# EAGLE schematic StepperController_v1-0 (EAGLE 7.5.0)

## Sheet 1 of 4
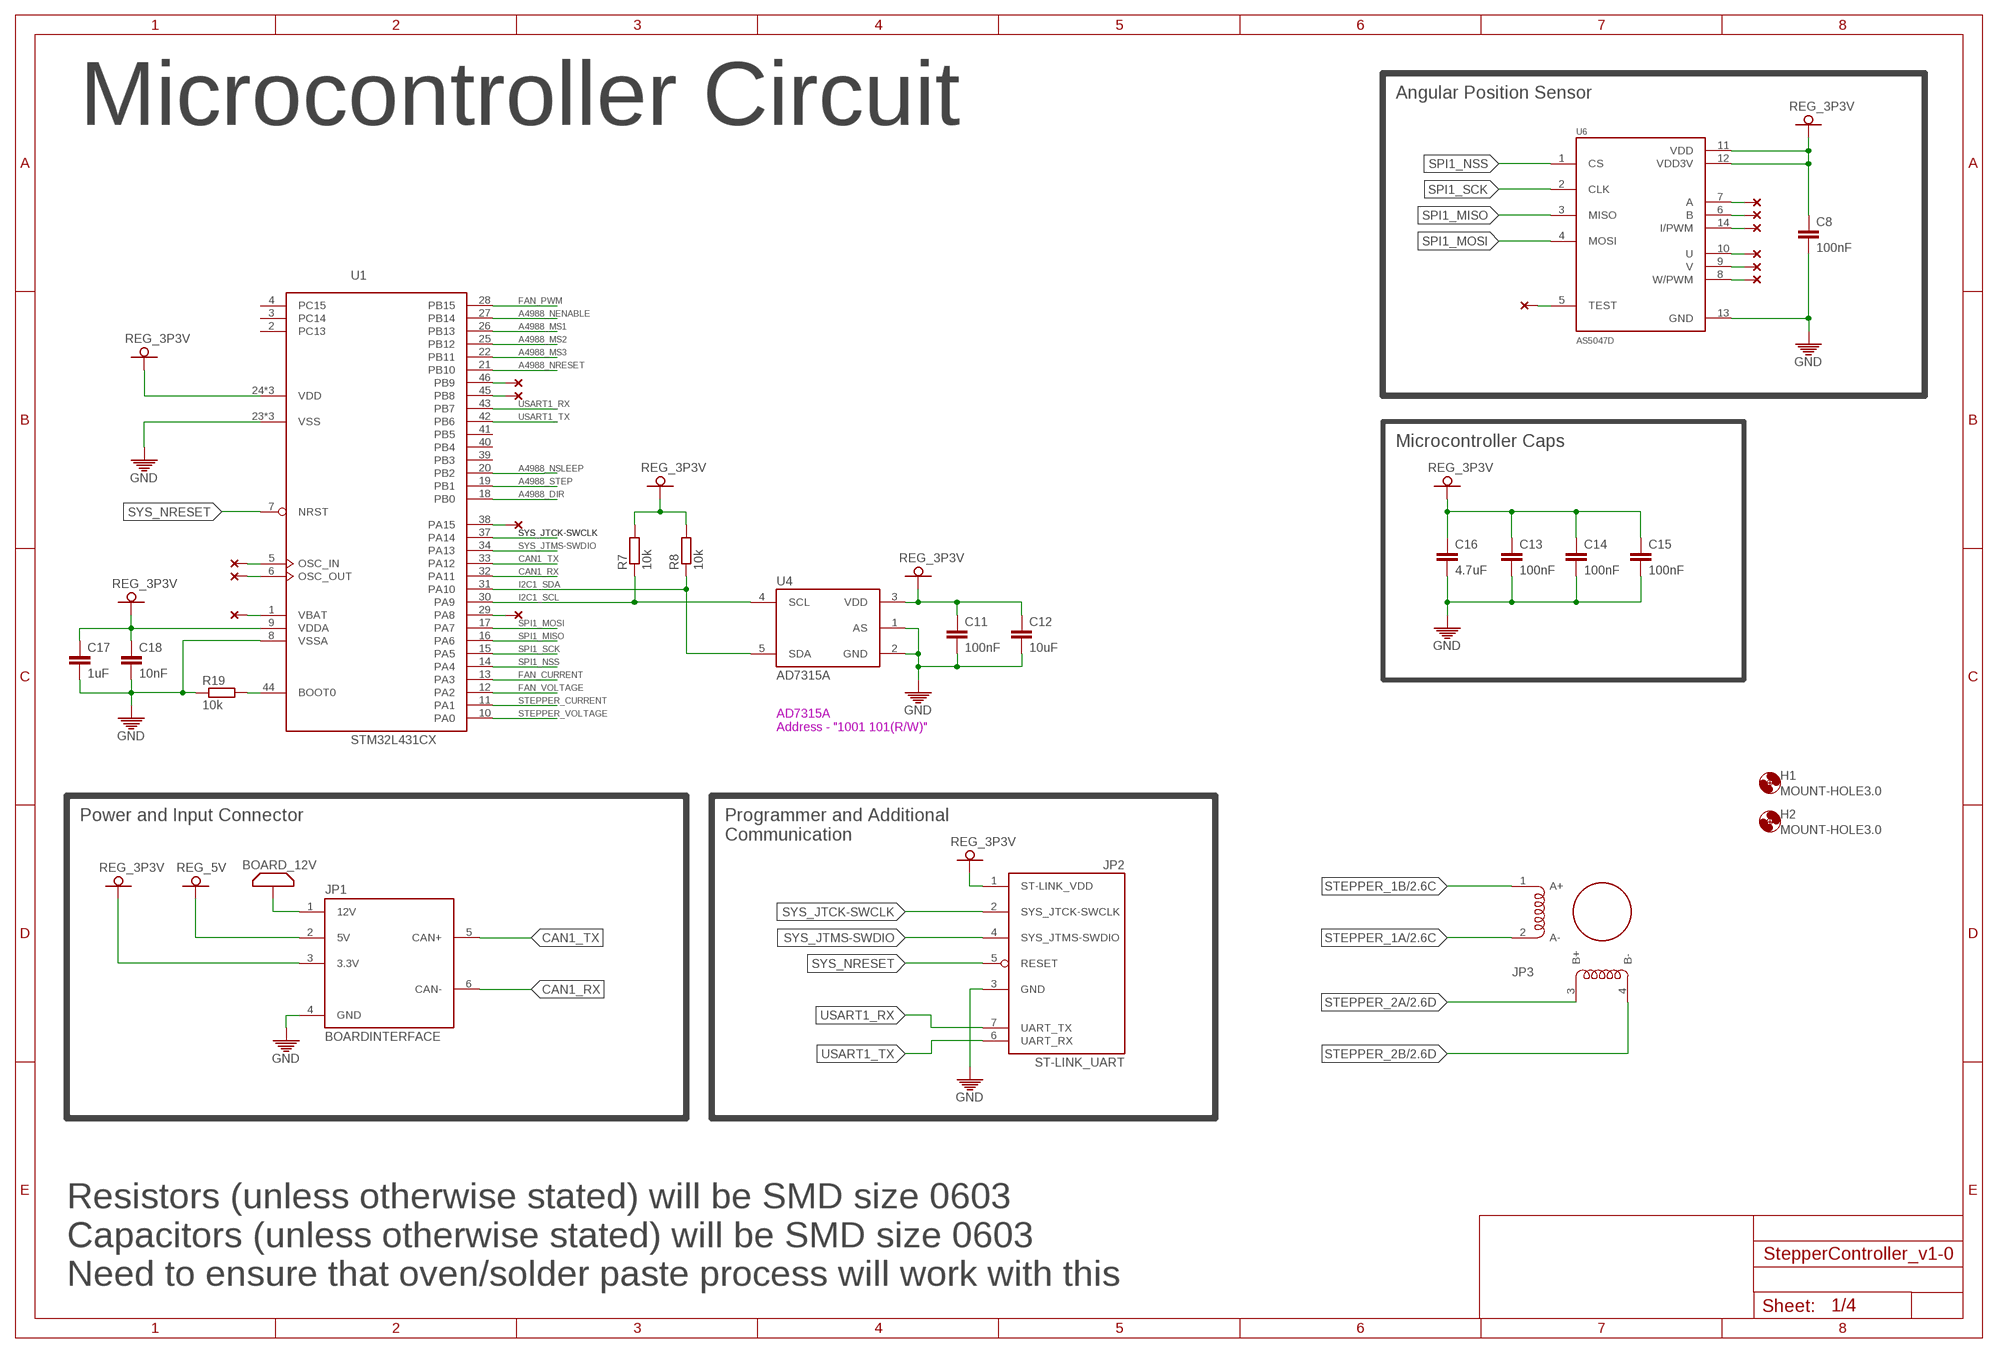
[diagram p0: schematic, sheet 1]

### Parts
C8  100nF  C-EUC0603  [C0603]
C11  100nF  C-EUC0603  [C0603]
C12  10uF  C-EUC0603  [C0603]
C13  100nF  C-EUC0603  [C0603]
C14  100nF  C-EUC0603  [C0603]
C15  100nF  C-EUC0603  [C0603]
C16  4.7uF  C-EUC0603  [C0603]
C17  1uF  C-EUC0603  [C0603]
C18  10nF  C-EUC0603  [C0603]
H1  MOUNT-HOLE3.0  [3,0]
H2  MOUNT-HOLE3.0  [3,0]
JP1  BOARDINTERFACE  [S6B-PH-SM4-TB]
JP2  ST-LINK_UART  [JP7]
JP3  NEMA17  [JP4]
R7  10k  R-EU_R0603  [R0603]
R8  10k  R-EU_R0603  [R0603]
R19  10k  R-EU_R0603  [R0603]
U1  STM32L431CX  [LQFP48]
U4  AD7315A  [SOT23-5L]
U6  AS5047D  [TSSOP14]
U$1  NOTCONNECTED  (no package)
U$2  NOTCONNECTED  (no package)
U$3  NOTCONNECTED  (no package)
U$4  NOTCONNECTED  (no package)
U$6  NOTCONNECTED  (no package)
U$8  NOTCONNECTED  (no package)
U$9  NOTCONNECTED  (no package)
U$15  NOTCONNECTED  (no package)
U$16  NOTCONNECTED  (no package)
U$17  NOTCONNECTED  (no package)
U$18  NOTCONNECTED  (no package)
U$19  NOTCONNECTED  (no package)
U$20  NOTCONNECTED  (no package)
U$21  NOTCONNECTED  (no package)

### Nets
A4988_DIR: U1.18(PB0) ; also sheet 2
A4988_MS1: U1.26(PB13) ; also sheet 2
A4988_MS2: U1.25(PB12) ; also sheet 2
A4988_MS3: U1.22(PB11) ; also sheet 2
A4988_NENABLE: U1.27(PB14) ; also sheet 2
A4988_NRESET: U1.21(PB10) ; also sheet 2
A4988_NSLEEP: U1.20(PB2) ; also sheet 2
A4988_STEP: U1.19(PB1) ; also sheet 2
BOARD_12V: JP1.1(12V) ; also sheet 2
CAN1_RX: JP1.6(CAN-) U1.32(PA11)
CAN1_TX: JP1.5(CAN+) U1.33(PA12)
FAN_CURRENT: U1.13(PA3) ; also sheet 3
FAN_PWM: U1.28(PB15) ; also sheet 3
FAN_VOLTAGE: U1.12(PA2) ; also sheet 3
GND: C8.2 C11.2 C12.2 C13.2 C14.2 C15.2 C16.2 C17.2 C18.2 JP1.4(GND) JP2.3(GND) R19.1 U1.8(VSSA) U1.23(VSS) U1.35(VSS) U1.47(VSS) U4.1(AS) U4.2(GND) U6.13(GND) ; also sheet 2,3
I2C1_SCL: R7.1 U1.30(PA9) U4.4(SCL)
I2C1_SDA: R8.1 U1.31(PA10) U4.5(SDA)
N$1: U1.38(PA15) U$3.NC
N$2: U1.29(PA8) U$2.NC
N$3: U1.45(PB8) U$4.NC
N$4: U1.46(PB9) U$6.NC
N$5: U1.5(OSC_IN) U$8.NC
N$6: U1.6(OSC_OUT) U$9.NC
N$8: R19.2 U1.44(BOOT0)
N$9: U1.1(VBAT) U$1.NC
N$18: U6.7(A) U$15.NC
N$19: U6.6(B) U$16.NC
N$20: U6.14(I/PWM) U$17.NC
N$21: U6.10(U) U$18.NC
N$22: U6.9(V) U$20.NC
N$23: U6.8(W/PWM) U$19.NC
N$24: U6.5(TEST) U$21.NC
REG_3P3V: C8.1 C11.1 C12.1 C13.1 C14.1 C15.1 C16.1 C17.1 C18.1 JP1.3(3.3V) JP2.1(ST-LINK_VDD) R7.2 R8.2 U1.9(VDDA) U1.24(VDD) U1.36(VDD) U1.48(VDD) U4.3(VDD) U6.11(VDD) U6.12(VDD3V) ; also sheet 2,3
REG_5V: JP1.2(5V) ; also sheet 3
SPI1_MISO: U1.16(PA6) U6.3(MISO)
SPI1_MOSI: U1.17(PA7) U6.4(MOSI)
SPI1_NSS: U1.14(PA4) U6.1(CS)
SPI1_SCK: U1.15(PA5) U6.2(CLK)
STEPPER_1A: JP3.2(A-) ; also sheet 2
STEPPER_1B: JP3.1(A+) ; also sheet 2
STEPPER_2A: JP3.3(B+) ; also sheet 2
STEPPER_2B: JP3.4(B-) ; also sheet 2
STEPPER_CURRENT: U1.11(PA1) ; also sheet 2
STEPPER_VOLTAGE: U1.10(PA0) ; also sheet 2
SYS_JTCK-SWCLK: JP2.2(SYS_JTCK-SWCLK) U1.37(PA14)
SYS_JTMS-SWDIO: JP2.4(SYS_JTMS-SWDIO) U1.34(PA13)
SYS_NRESET: JP2.5(RESET) U1.7(NRST)
USART1_RX: JP2.7(UART_TX) U1.43(PB7)
USART1_TX: JP2.6(UART_RX) U1.42(PB6)
Unconnected: U1.2(PC13) U1.3(PC14) U1.4(PC15) U1.39(PB3) U1.40(PB4) U1.41(PB5)

### Notes on the sheet
- Angular Position Sensor
- Microcontroller Circuit
- Microcontroller Caps
- AD7315A
  Address - "1001 101(R/W)"
- Power and Input Connector
- Programmer and Additional
  Communication
- Resistors (unless otherwise stated) will be SMD size 0603
  Capacitors (unless otherwise stated) will be SMD size 0603
  Need to ensure that oven/solder paste process will work with this

## Sheet 2 of 4
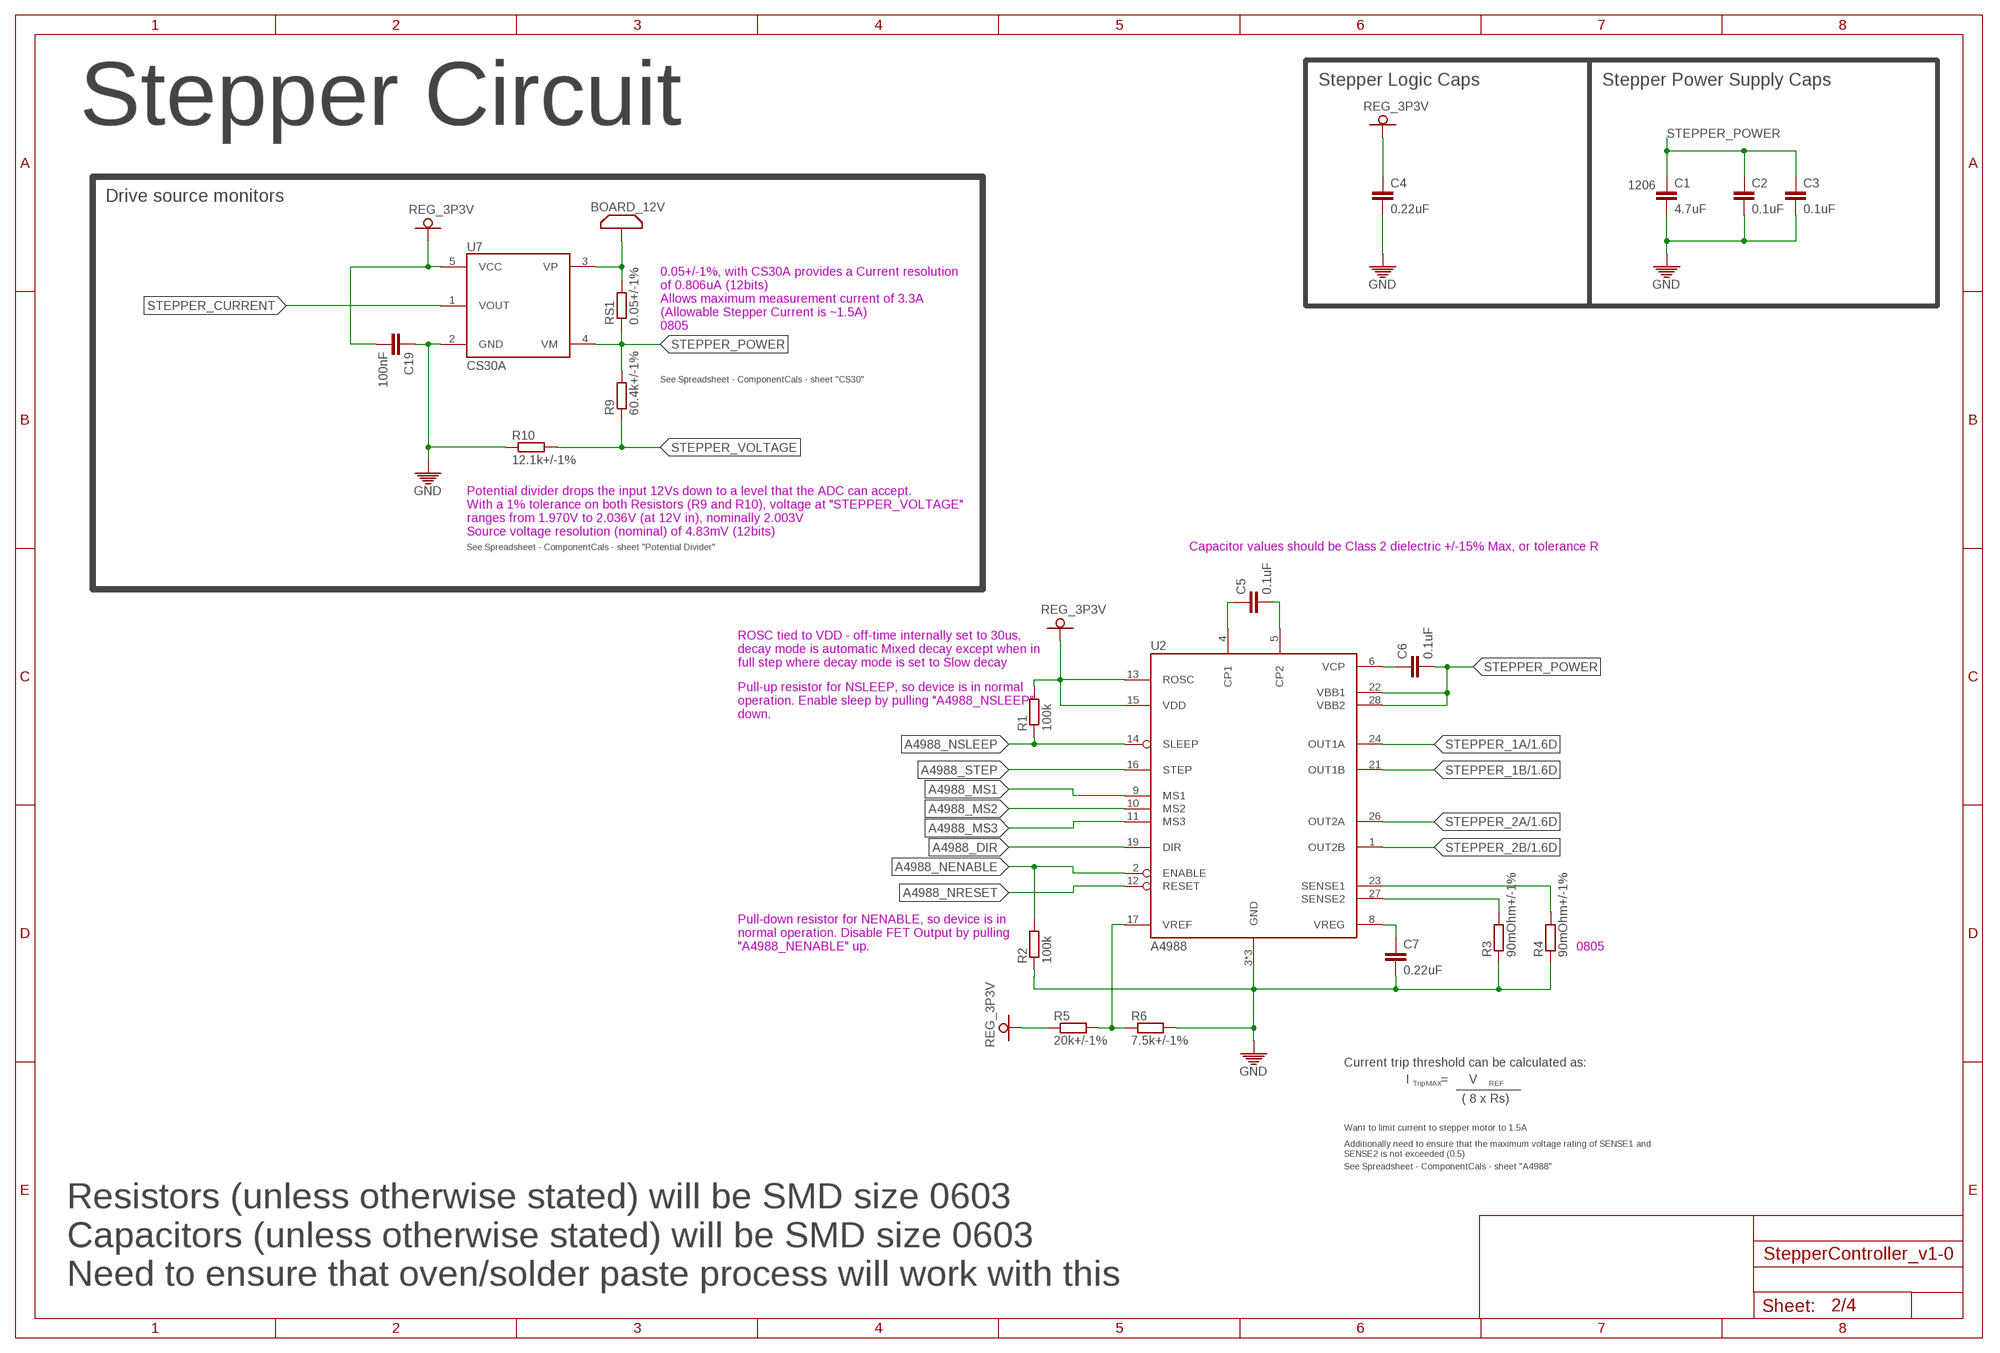
[diagram p1: schematic, sheet 2]

### Parts
C1  4.7uF  C-EUC1206  [C1206]
C2  0.1uF  C-EUC0603  [C0603]
C3  0.1uF  C-EUC0603  [C0603]
C4  0.22uF  C-EUC0603  [C0603]
C5  0.1uF  C-EUC0603  [C0603]
C6  0.1uF  C-EUC0603  [C0603]
C7  0.22uF  C-EUC0603  [C0603]
C19  100nF  C-EUC0603  [C0603]
R1  100k  R-EU_R0603  [R0603]
R2  100k  R-EU_R0603  [R0603]
R3  90mOhm+/-1%  R-EU_R0805  [R0805]
R4  90mOhm+/-1%  R-EU_R0805  [R0805]
R5  20k+/-1%  R-EU_R0603  [R0603]
R6  7.5k+/-1%  R-EU_R0603  [R0603]
R9  60.4k+/-1%  R-EU_R0603  [R0603]
R10  12.1k+/-1%  R-EU_R0603  [R0603]
RS1  0.05+/-1%  R-EU_R0805  [R0805]
U2  A4988  [QFN-28-5MM]
U7  CS30A  [SOT23-5L]

### Nets
A4988_DIR: U2.19(DIR) ; also sheet 1
A4988_MS1: U2.9(MS1) ; also sheet 1
A4988_MS2: U2.10(MS2) ; also sheet 1
A4988_MS3: U2.11(MS3) ; also sheet 1
A4988_NENABLE: R2.2 U2.2(ENABLE) ; also sheet 1
A4988_NRESET: U2.12(RESET) ; also sheet 1
A4988_NSLEEP: R1.1 U2.14(SLEEP) ; also sheet 1
A4988_STEP: U2.16(STEP) ; also sheet 1
BOARD_12V: RS1.2 U7.3(VP) ; also sheet 1
GND: C1.2 C2.2 C3.2 C4.2 C7.2 C19.1 R2.1 R3.1 R4.1 R6.2 R10.1 U2.3(GND) U2.18(GND) U2.29(GND) U7.2(GND) ; also sheet 1,3
N$10: R3.2 U2.27(SENSE2)
N$11: C6.1 U2.6(VCP)
N$12: C5.1 U2.4(CP1)
N$13: C5.2 U2.5(CP2)
N$14: R4.2 U2.23(SENSE1)
N$15: C7.1 U2.8(VREG)
N$16: R5.2 R6.1 U2.17(VREF)
REG_3P3V: C4.1 C19.2 R1.2 R5.1 U2.13(ROSC) U2.15(VDD) U7.5(VCC) ; also sheet 1,3
STEPPER_1A: U2.24(OUT1A) ; also sheet 1
STEPPER_1B: U2.21(OUT1B) ; also sheet 1
STEPPER_2A: U2.26(OUT2A) ; also sheet 1
STEPPER_2B: U2.1(OUT2B) ; also sheet 1
STEPPER_CURRENT: U7.1(VOUT) ; also sheet 1
STEPPER_POWER: C1.1 C2.1 C3.1 C6.2 R9.2 RS1.1 U2.22(VBB1) U2.28(VBB2) U7.4(VM)
STEPPER_VOLTAGE: R9.1 R10.2 ; also sheet 1

### Notes on the sheet
- Stepper Logic Caps | Stepper Power Supply Caps
- Stepper Circuit
- Drive source monitors | 1206
- 0.05+/-1%, with CS30A provides a Current resolution
  of 0.806uA (12bits)
  Allows maximum measurement current of 3.3A
  (Allowable Stepper Current is ~1.5A)
  0805
- See Spreadsheet - ComponentCals - sheet "CS30"
- Potential divider drops the input 12Vs down to a level that the ADC can accept.
  With a 1% tolerance on both Resistors (R9 and R10), voltage at "STEPPER_VOLTAGE"
  ranges from 1.970V to 2.036V (at 12V in), nominally 2.003V
  Source voltage resolution (nominal) of 4.83mV (12bits)
- See Spreadsheet - ComponentCals - sheet "Potential Divider" | Capacitor values should be Class 2 dielectric +/-15% Max, or tolerance R
- ROSC tied to VDD - off-time internally set to 30us,
  decay mode is automatic Mixed decay except when in
  full step where decay mode is set to Slow decay
- Pull-up resistor for NSLEEP, so device is in normal 
  operation. Enable sleep by pulling "A4988_NSLEEP"
  down.
- Pull-down resistor for NENABLE, so device is in 
  normal operation. Disable FET Output by pulling
  "A4988_NENABLE" up.
- 0805
- Current trip threshold can be calculated as:
- I         =      V
- TripMAX | REF
- ( 8 x Rs)
- Want to limit current to stepper motor to 1.5A
- Additionally need to ensure that the maximum voltage rating of SENSE1 and 
  SENSE2 is not exceeded (0.5)
- See Spreadsheet - ComponentCals - sheet "A4988"
- Resistors (unless otherwise stated) will be SMD size 0603
  Capacitors (unless otherwise stated) will be SMD size 0603
  Need to ensure that oven/solder paste process will work with this

## Sheet 3 of 4
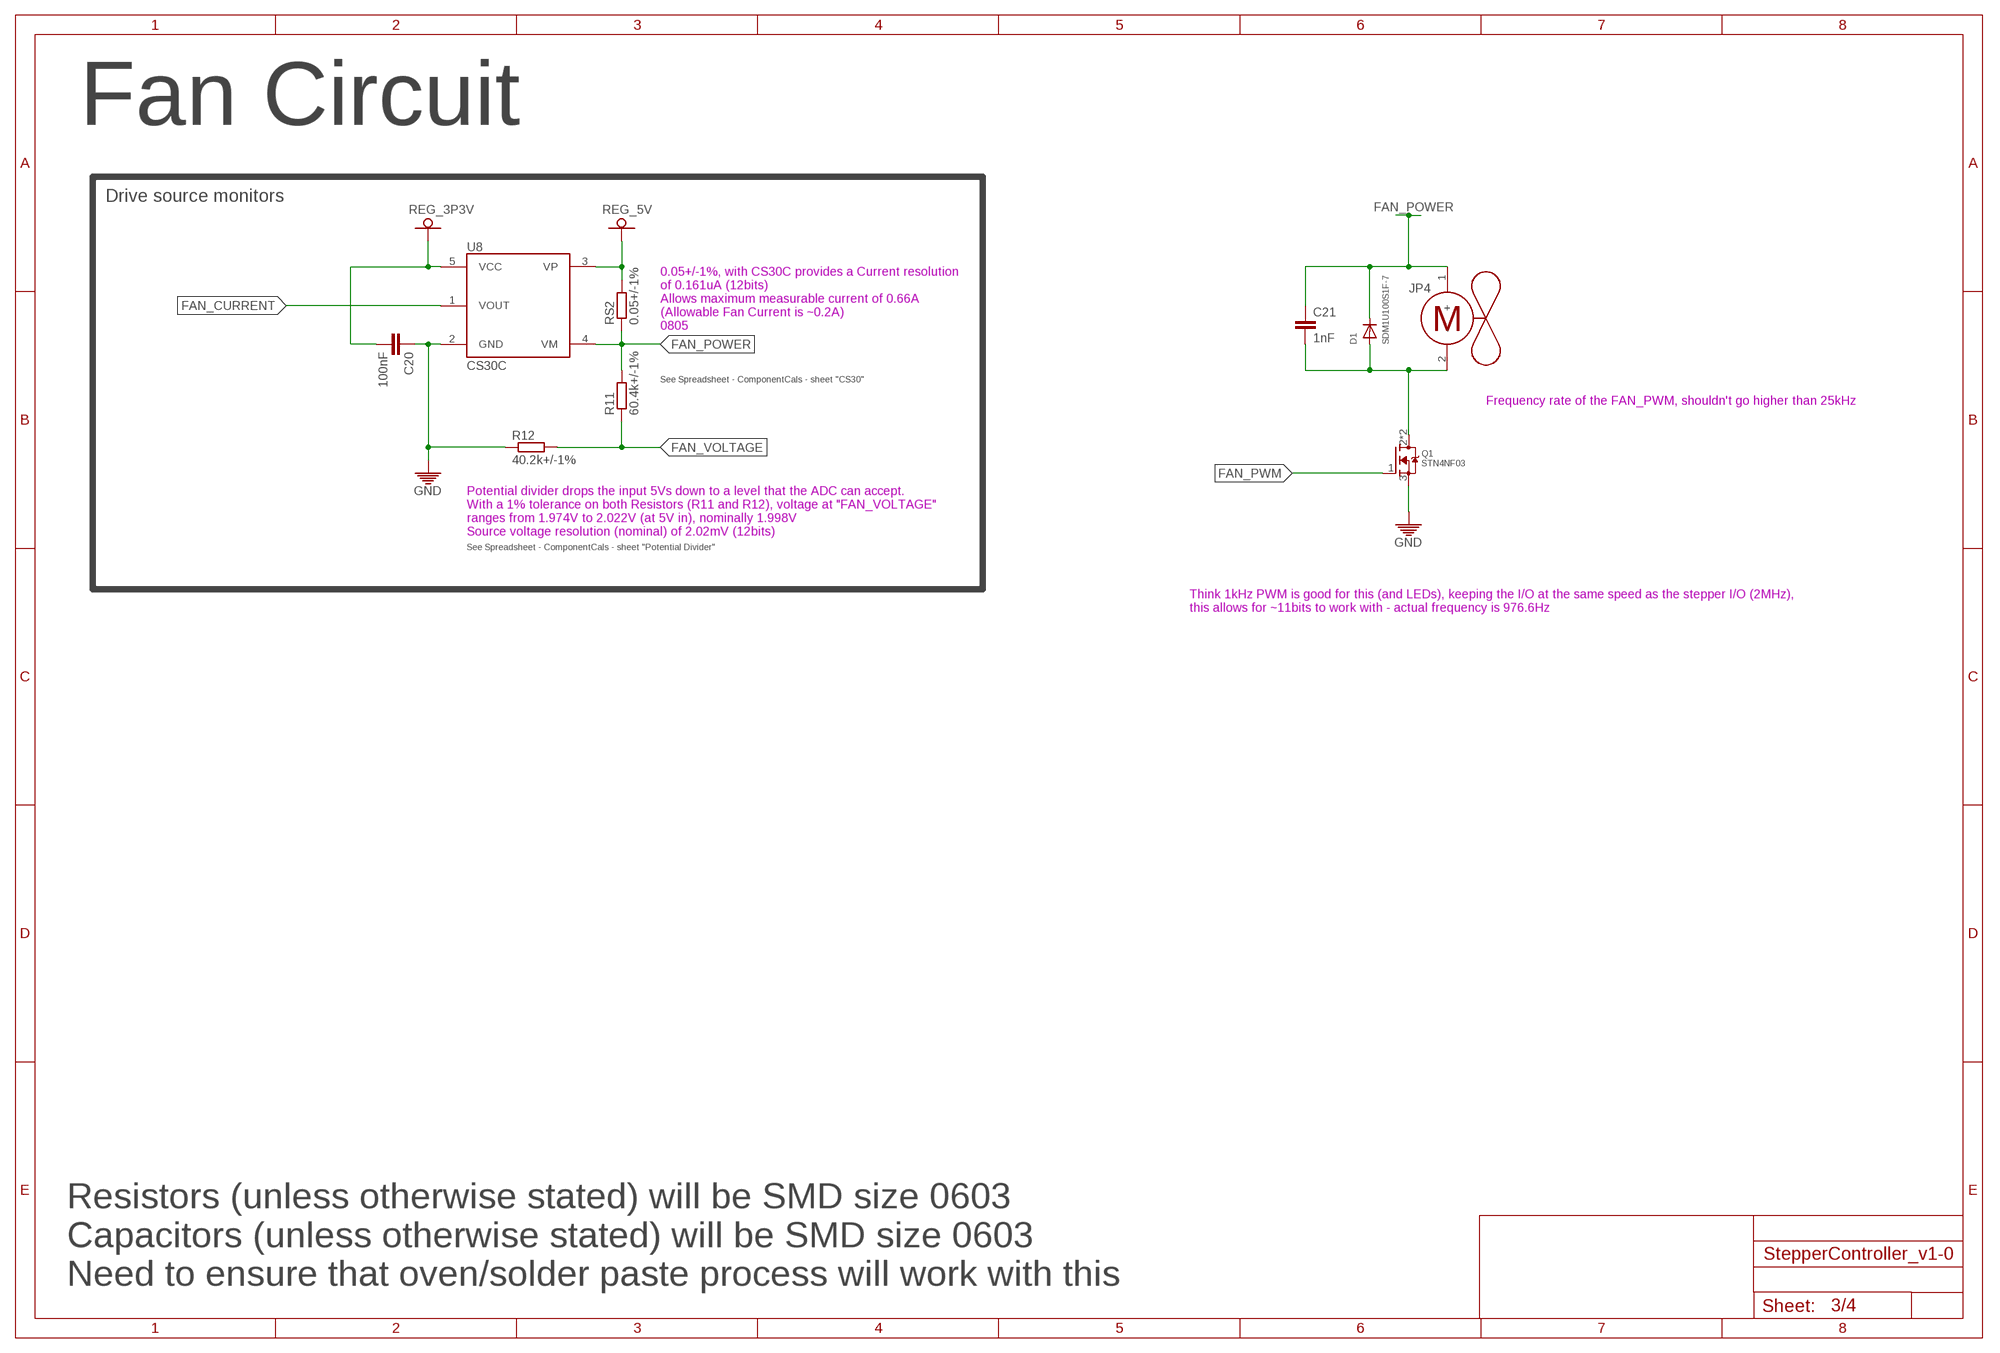
[diagram p2: schematic, sheet 3]

### Parts
C20  100nF  C-EUC0603  [C0603]
C21  1nF  C-EUC0603  [C0603]
D1  SDM1U100S1F-7  [SOD123F]
JP4  MC33873  [JP1Y]
Q1  STN4NF03  [SOT223]
R11  60.4k+/-1%  R-EU_R0603  [R0603]
R12  40.2k+/-1%  R-EU_R0603  [R0603]
RS2  0.05+/-1%  R-EU_R0805  [R0805]
U8  CS30C  [SOT23-5L]

### Nets
FAN_CURRENT: U8.1(VOUT) ; also sheet 1
FAN_POWER: C21.1 D1.C JP4.1(+) R11.2 RS2.1 U8.4(VM)
FAN_PWM: Q1.1(G) ; also sheet 1
FAN_VOLTAGE: R11.1 R12.2 ; also sheet 1
GND: C20.1 Q1.3(S) R12.1 U8.2(GND) ; also sheet 1,2
N$32: C21.2 D1.A JP4.2(-) Q1.2(D) Q1.4(D)
REG_3P3V: C20.2 U8.5(VCC) ; also sheet 1,2
REG_5V: RS2.2 U8.3(VP) ; also sheet 1

### Notes on the sheet
- Fan Circuit
- Drive source monitors
- 0.05+/-1%, with CS30C provides a Current resolution
  of 0.161uA (12bits)
  Allows maximum measurable current of 0.66A
  (Allowable Fan Current is ~0.2A)
  0805
- See Spreadsheet - ComponentCals - sheet "CS30"
- Frequency rate of the FAN_PWM, shouldn't go higher than 25kHz
- Potential divider drops the input 5Vs down to a level that the ADC can accept.
  With a 1% tolerance on both Resistors (R11 and R12), voltage at "FAN_VOLTAGE"
  ranges from 1.974V to 2.022V (at 5V in), nominally 1.998V
  Source voltage resolution (nominal) of 2.02mV (12bits)
- See Spreadsheet - ComponentCals - sheet "Potential Divider"
- Think 1kHz PWM is good for this (and LEDs), keeping the I/O at the same speed as the stepper I/O (2MHz),
  this allows for ~11bits to work with - actual frequency is 976.6Hz
- Resistors (unless otherwise stated) will be SMD size 0603
  Capacitors (unless otherwise stated) will be SMD size 0603
  Need to ensure that oven/solder paste process will work with this

## Sheet 4 of 4
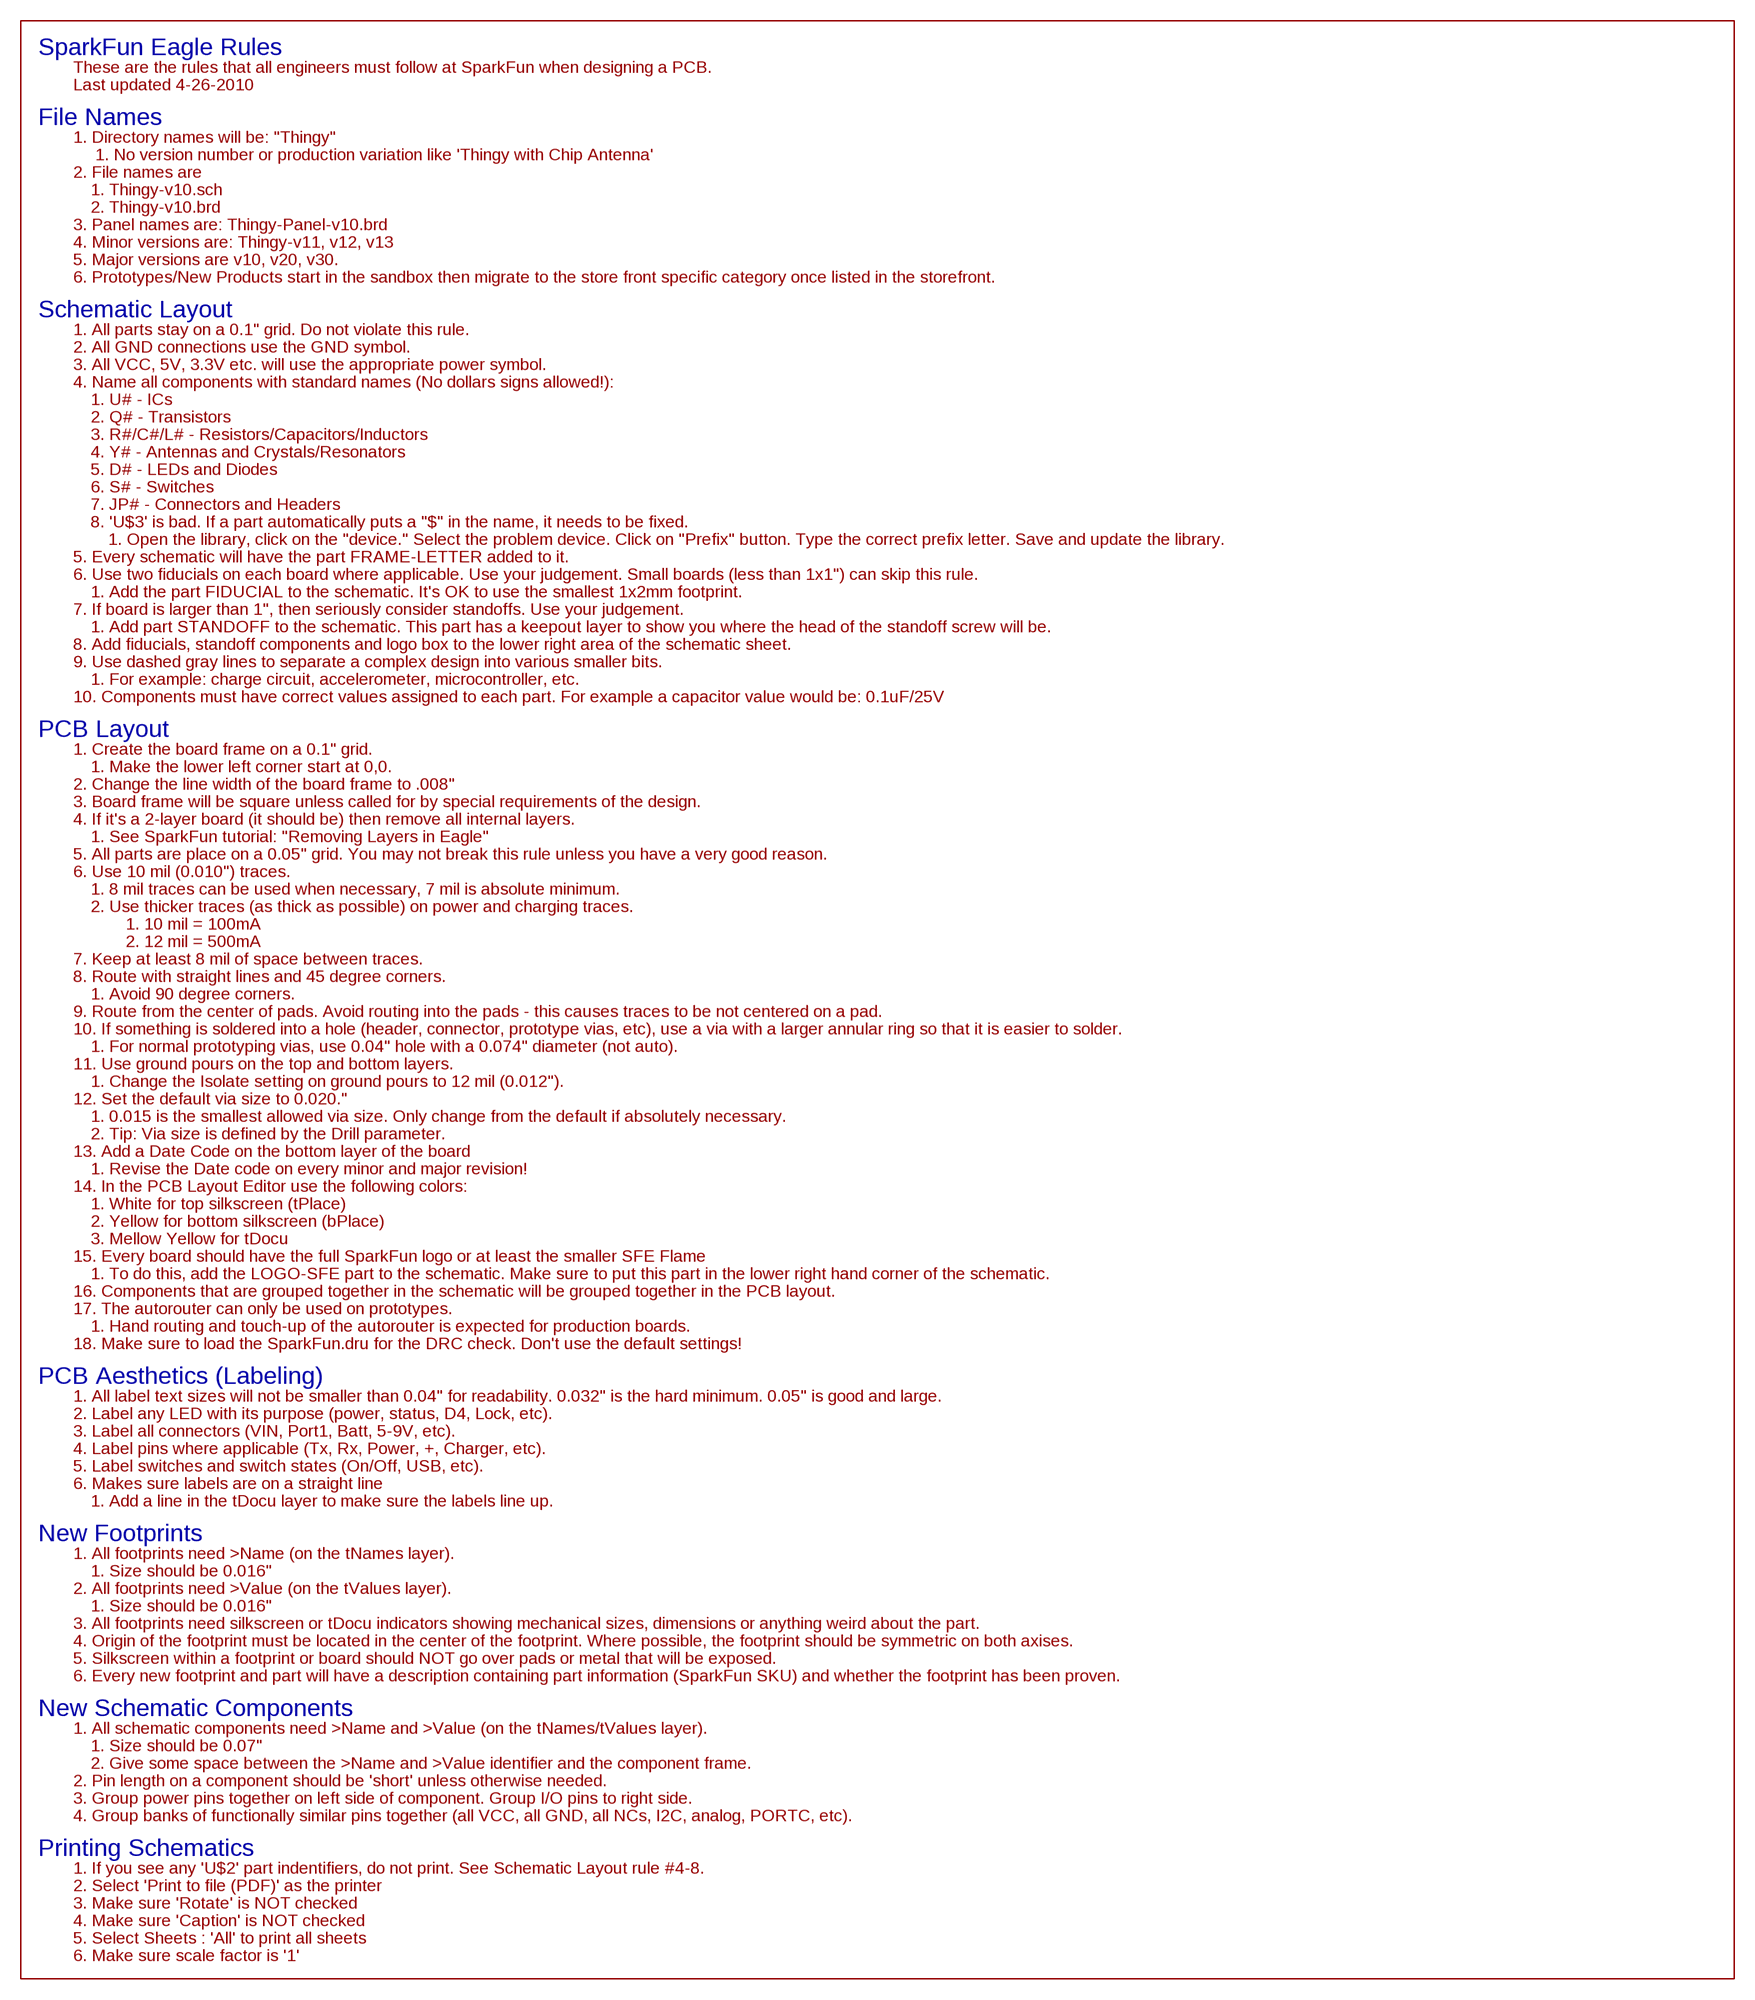
[diagram p3: schematic, sheet 4]

## Library data of the parts
C1-C8 C11-C21 = resistor:C-EU: CAPACITOR, European symbol
D1 = ()_StepperMotor_Library:SDM1U100S1F-7
H1 H2 = holes:MOUNT-HOLE: MOUNTING HOLE with drill center marker
JP1 = ()_StepperMotor_Library:BOARDINTERFACE
JP2 = ()_StepperMotor_Library:ST-LINK_UART
JP3 = ()_StepperMotor_Library:NEMA17
JP4 = ()_StepperMotor_Library:MC33873
Q1 = ()_StepperMotor_Library:STN4NF03
R1-R12 R19 RS1 RS2 = resistor:R-EU_: RESISTOR, European symbol
U1 = ()_StepperMotor_Library:STM32L431CX
U2 = ()_StepperMotor_Library:A4988
U4 = ()_StepperMotor_Library:AD7315A
U6 = ()_StepperMotor_Library:AS5047D
U7 = ()_StepperMotor_Library:CS30A
U8 = ()_StepperMotor_Library:CS30C
U$1-U$4 U$6 U$8 U$9 U$15-U$21 = ()_mipi_Library:NOTCONNECTED